# EAGLE schematic buttons (EAGLE 7.7.0)
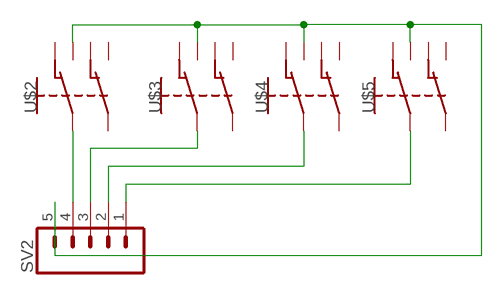
[diagram p0: schematic, sheet 1]

## Parts
SV2  CONN_05  [1X05]
U$2  PVA2-OA  [PVA]
U$3  PVA2-OA  [PVA]
U$4  PVA2-OA  [PVA]
U$5  PVA2-OA  [PVA]

## Nets
N$2: SV2.4 U$2.0
N$3: SV2.3 U$3.0
N$4: SV2.2 U$4.0
N$5: SV2.1 U$5.0
N$6: SV2.5 U$2.2 U$3.2 U$4.2 U$5.2
Unconnected: U$2.0' U$2.1 U$2.1' U$2.2' U$3.0' U$3.1 U$3.1' U$3.2' U$4.0' U$4.1 U$4.1' U$4.2' U$5.0' U$5.1 U$5.1' U$5.2'

## Library data of the parts
SV2 = SparkFun-Connectors:CONN_05: Multi connection point. Often used as Generic Header-pin footprint for 0.1 inch spaced/style header connections On any of the 0.1 inch spaced packages, you can populate with these: Break Away Headers - Straight <https://www.sparkfun.com/products/116> (PRT-00116) Break Away Male Headers - Right Angle <https://www.sparkfun.com/products/553> (PRT-00553) Female Headers <https://www.sparkfun.com/products/115> (PRT-00115) Break Away Headers - Machine Pin <https://www.sparkfun.com/products/117> (PRT-00117) Break Away Female Headers - Swiss Machine Pin <https://www.sparkfun.com/products/743> (PRT-00743) For SCREWTERMINALS and SPRING TERMINALS visit here: Screw Terimnals on SparkFun.com <https://www.sparkfun.com/search/results?term=Screw+Terminals> (5mm/3.5mm/2.54mm spacing) This device is also useful as a general connection point to wire up your design to another part of your project. Our various solder wires solder well into these plated through hole pads. Hook-Up Wire - Assortment (Stranded, 22 AWG) <https://www.sparkfun.com/products/11375> (PRT-11375) Hook-Up Wire - Assortment (Solid Core, 22 AWG) <https://www.sparkfun.com/products/11367> (PRT-11367) View the entire wire category on our website here <https://www.sparkfun.com/categories/141> Special notes: Molex polarized connector foot print use with SKU : PRT-08231 with associated crimp pins and housings. 1MM SMD Version SKU: PRT-10208
U$2-U$5 = Sega:PVA2-OA: C&K Short Stroke Key Switches Datasheet: http://www.ckswitches.com/media/1343/pva.pdf; HEIGHT: 17.54

## Net classes
0 default: width 0.508 mm